# EAGLE design bl_interf (EAGLE 9.4.2)
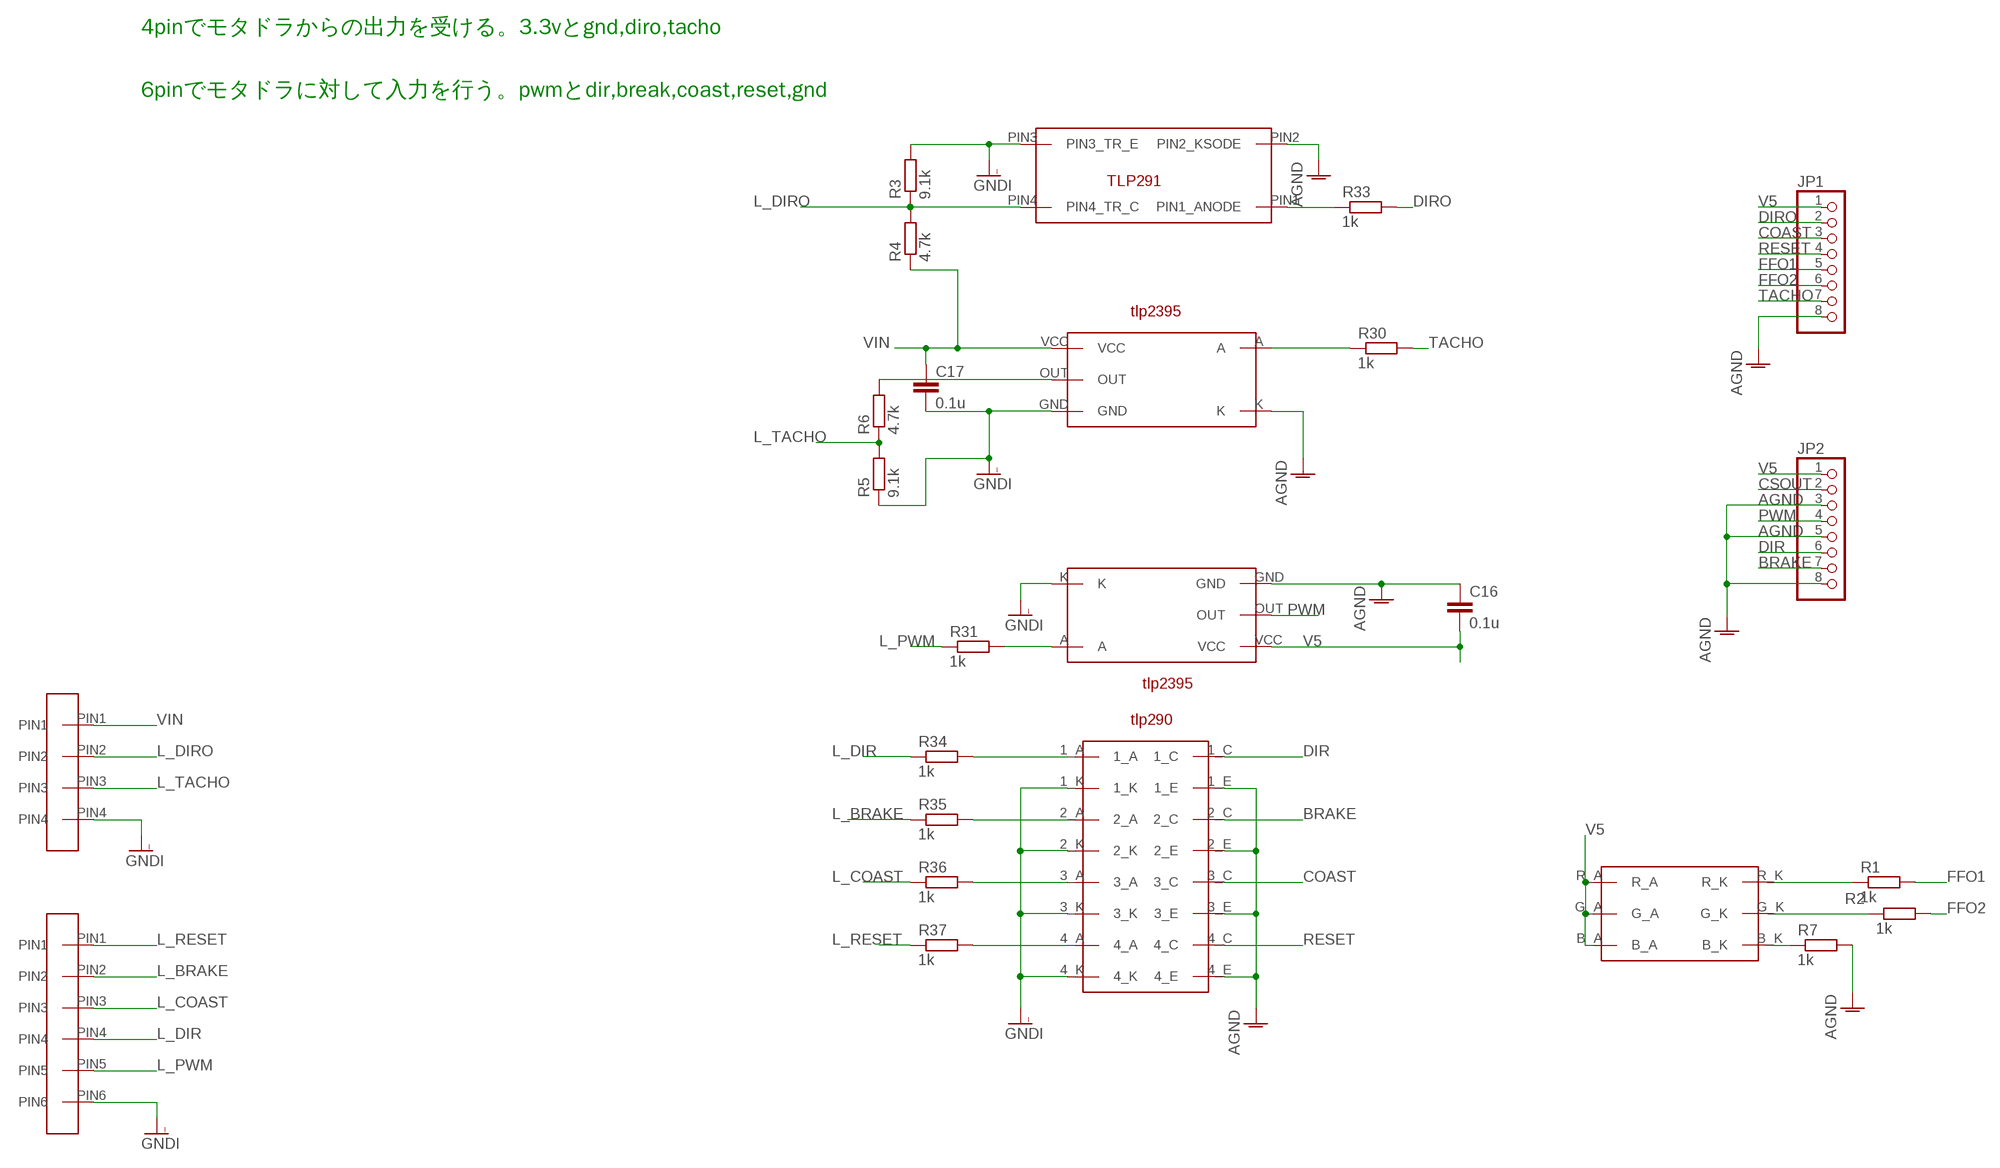
[diagram p0: schematic, sheet 1]

## Parts
C16  0.1u  C-EUC2012  [C2012]
C17  0.1u  C-EUC2012  [C2012]
JP1  PINHD-1X8  [1X08]
JP2  PINHD-1X8  [1X08]
R1  1k  R-EU_M2012  [M2012]
R2  1k  R-EU_M2012  [M2012]
R3  9.1k  R-EU_M2012  [M2012]
R4  4.7k  R-EU_M2012  [M2012]
R5  9.1k  R-EU_M2012  [M2012]
R6  4.7k  R-EU_M2012  [M2012]
R7  1k  R-EU_M2012  [M2012]
R30  1k  R-EU_M2012  [M2012]
R31  1k  R-EU_M2012  [M2012]
R33  1k  R-EU_M2012  [M2012]
R34  1k  R-EU_M2012  [M2012]
R35  1k  R-EU_M2012  [M2012]
R36  1k  R-EU_M2012  [M2012]
R37  1k  R-EU_M2012  [M2012]
U$1  RGB_LED  [RGB_LED]
U$17  TLP2395  [TLP2395]
U$18  TLP2395  [TLP2395]
U$19  TLP291  [TLP291]
U$20  TLP290-4  [TLP290]
U$21  DF1B_L_4P  [DF1B_L_4P]
U$22  DF1B_L_6P  [DF1B_L_6P]

## Nets
AGND: C16.1 JP1.8 JP2.3 JP2.5 JP2.8 R7.2 U$17.K U$18.GND U$19.PIN2(PIN2_KSODE) U$20.1_E U$20.2_E U$20.3_E U$20.4_E
BRAKE: JP2.7 U$20.2_C
COAST: JP1.3 U$20.3_C
CSOUT: JP2.2
DIR: JP2.6 U$20.1_C
DIRO: JP1.2 R33.2
FFO1: JP1.5 R1.2
FFO2: JP1.6 R2.2
GNDI: C17.2 R3.2 R5.1 U$17.GND U$18.K U$19.PIN3(PIN3_TR_E) U$20.1_K U$20.2_K U$20.3_K U$20.4_K U$21.PIN4 U$22.PIN6
L_BRAKE: R35.1 U$22.PIN2
L_COAST: R36.1 U$22.PIN3
L_DIR: R34.1 U$22.PIN4
L_DIRO: R3.1 R4.2 U$19.PIN4(PIN4_TR_C) U$21.PIN2
L_PWM: R31.1 U$22.PIN5
L_RESET: R37.1 U$22.PIN1
L_TACHO: R5.2 R6.1 U$21.PIN3
N$1: R7.1 U$1.B_K
N$2: R1.1 U$1.R_K
N$3: R2.1 U$1.G_K
N$34: R30.1 U$17.A
N$40: R31.2 U$18.A
N$41: R6.2 U$17.OUT
N$42: R34.2 U$20.1_A
N$43: R33.1 U$19.PIN1(PIN1_ANODE)
N$44: R35.2 U$20.2_A
N$45: R36.2 U$20.3_A
N$46: R37.2 U$20.4_A
PWM: JP2.4 U$18.OUT
RESET: JP1.4 U$20.4_C
TACHO: JP1.7 R30.2
V5: C16.2 JP1.1 JP2.1 U$1.B_A U$1.G_A U$1.R_A U$18.VCC
VIN: C17.1 R4.1 U$17.VCC U$21.PIN1

## Notes on the sheet
- 4pinでモタドラからの出力を受ける。3.3vとgnd,diro,tacho
- 6pinでモタドラに対して入力を行う。pwmとdir,break,coast,reset,gnd

## Library data of the parts
C16 C17 = rcl:C-EU: CAPACITOR, European symbol; SPICEPREFIX: C
JP1 JP2 = pinhead:PINHD-1X8: PIN HEADER
R1-R7 R30 R31 R33-R37 = rcl:R-EU_: RESISTOR, European symbol; SPICEPREFIX: R
U$1 = user:RGB_LED: 秋月電子通商 I-12726
U$17 U$18 = user:TLP2395
U$19 = user:TLP291
U$20 = user:TLP290-4
U$21 = user:DF1B_L_4P
U$22 = user:DF1B_L_6P

## Board
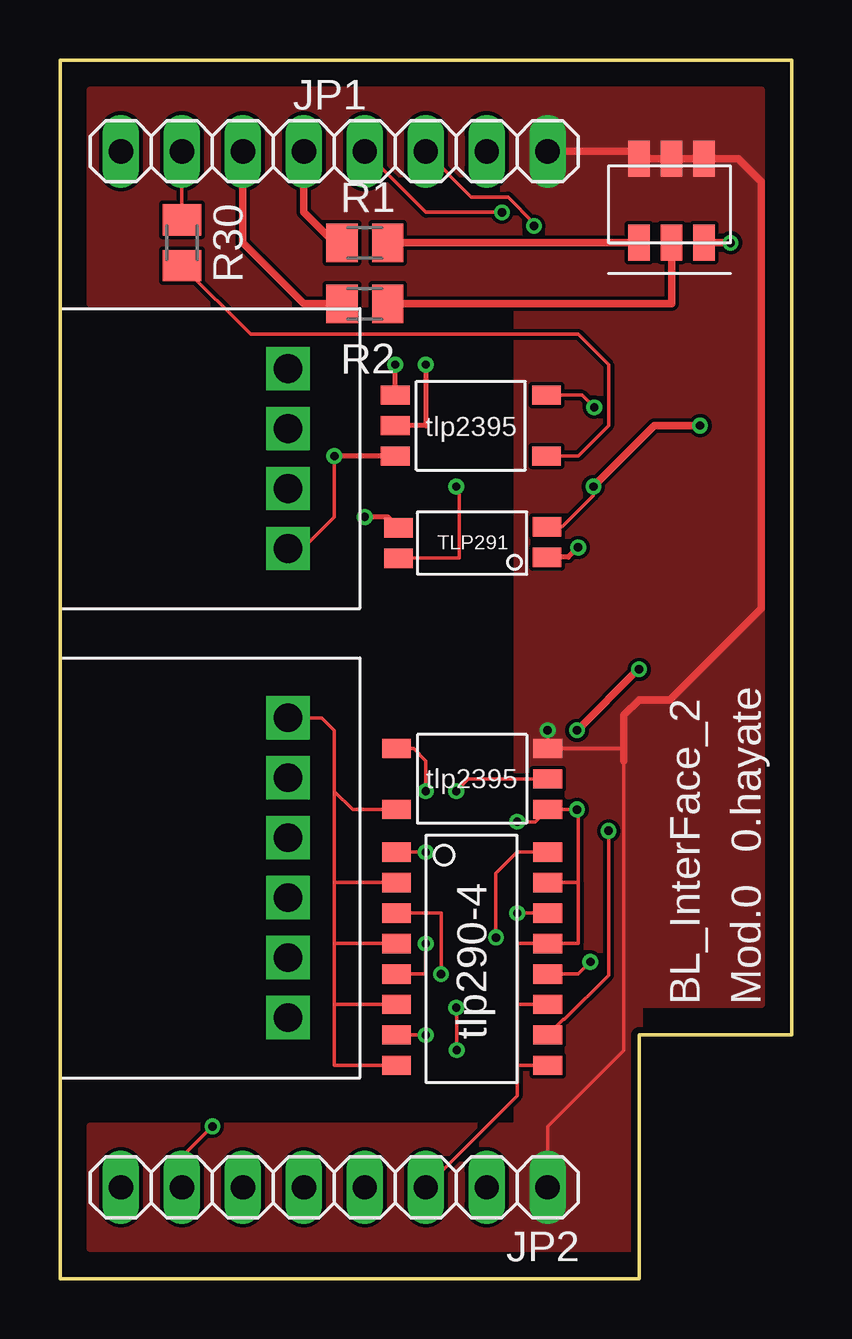
[diagram p1: board, top side]
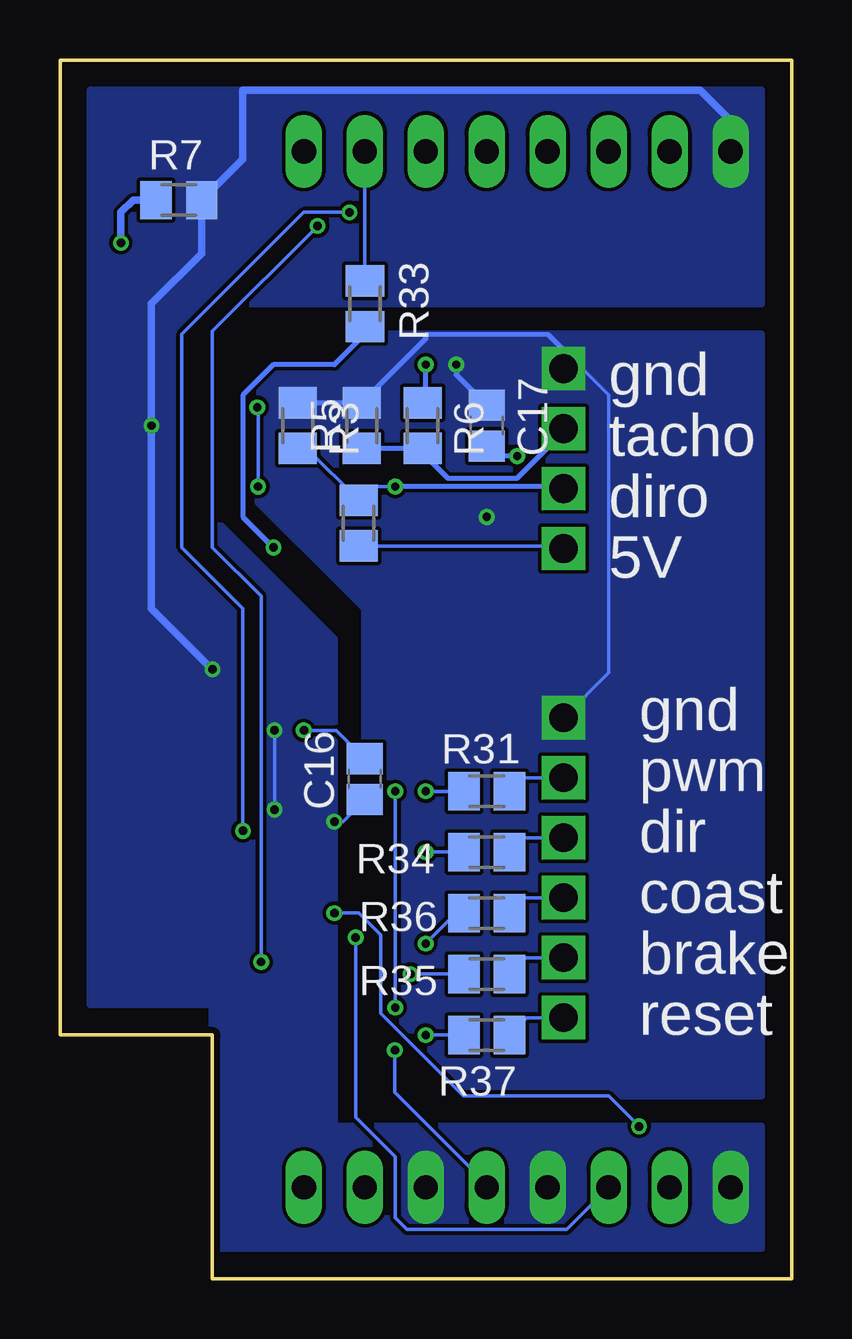
[diagram p2: board, bottom side, seen from below]

Size 30.48 x 50.8 mm. Coordinates in mm from the lower left corner, seen from the top.
Outline: 24.13,0 24.13,10.16 30.48,10.16 30.48,50.8 0,50.8 0,0 24.13,0
Copper layers (1*16): Top 0.035mm / dielectric 1.5mm / Bottom 0.035mm
Design rules "SeeedStudio_2layer_DRU_no_angle_20140221": minimum track width 6mil, minimum drill 12mil, track to track 6mil, track to pad 6mil, pad to pad 6mil, via to via 6mil, smd to smd 0mil, copper to edge 10mil, drill to drill 10mil, minimum pad ring 10mil, minimum via ring 6mil, stop-mask expansion 2mil, vias tented up to drill 100mil, thermal gap 10mil

### Footprints (pad centres in the part's own frame; a part is rotated, then mirrored left to right if it is on the bottom)
C2012 = smd 1.3 x 1.5: 1 -0.85,0; 2 0.85,0
1X08 = drill 1.016 long: 1 -8.89,0; 2 -6.35,0; 3 -3.81,0; 4 -1.27,0; 5 1.27,0; 6 3.81,0; 7 6.35,0; 8 8.89,0
M2012 = smd 1.3 x 1.6: 1 -0.95,0; 2 0.95,0
RGB_LED = smd 1.5 x 0.9: B_A 3.5,-2.7; B_K 0,-2.7; G_A 3.5,-1.35; G_K 0,-1.35; R_A 3.5,0; R_K 0,0
TLP2395 = smd 0.8 x 1.2: A 0,-6.3; GND 2.54,0; K 2.54,-6.3; OUT 1.27,0; VCC 0,0
TLP291 = smd 1.2 x 0.8: PIN1 0.411,-0.862; PIN2 0.411,-2.132; PIN3 6.601,-2.092; PIN4 6.601,-0.822
TLP290 = smd 0.8 x 1.2: 1_A 0,-6.3; 1_C 0,0; 1_E 1.27,0; 1_K 1.27,-6.3; 2_A 2.54,-6.3; 2_C 2.54,0; 2_E 3.81,0; 2_K 3.81,-6.3; 3_A 5.08,-6.3; 3_C 5.08,0; 3_E 6.35,0; 3_K 6.35,-6.3; 4_A 7.62,-6.3; 4_C 7.62,0; 4_E 8.89,0; 4_K 8.89,-6.3
DF1B_L_4P = drill 1.2 square: PIN1 2.5,-9.5; PIN2 5,-9.5; PIN3 7.5,-9.5; PIN4 10,-9.5
DF1B_L_6P = drill 1.2 square: PIN1 2.5,-9.5; PIN2 5,-9.5; PIN3 7.5,-9.5; PIN4 10,-9.5; PIN5 12.5,-9.5; PIN6 15,-9.5

### Placement (x,y rotation side)
C16  17.78,20.83 90 bottom
C17  12.7,35.56 90 bottom
JP1  11.43,46.99 180 top
JP2  11.43,3.81 180 top
R1  12.7,43.18 180 top
R2  12.7,40.64 180 top
R3  20.57,35.56 90 bottom
R4  18.03,31.5 90 bottom
R5  17.91,35.56 270 bottom
R6  15.37,35.56 90 bottom
R7  25.53,44.96 0 bottom
R30  5.08,43.18 90 top
R31  12.7,20.32 180 bottom
R33  17.78,40.64 90 bottom
R34  12.7,17.78 180 bottom
R35  12.7,12.7 180 bottom
R36  12.7,15.24 180 bottom
R37  12.7,10.16 180 bottom
U$1  24.13,43.18 90 top
U$17  13.97,34.29 90 top
U$18  20.32,22.1 270 top
U$19  20.7,29.21 180 top
U$20  20.32,17.78 270 top
U$21  0,27.94 90 top
U$22  0,8.38 90 top

### Tracks (layer width: path | path; a pad name or v marks a point on that pad's centre or on a via)
AGND  (via drill 0.35)
  Top 0.152: JP2.3 19.05,7.62 19.05,8.89 | 19.05,8.89 U$20.4_E | 19.05,8.89 19.05,11.43 | 19.05,11.43 U$20.3_E | 19.05,11.43 19.05,13.97 U$20.2_E 21.59,13.97 21.59,16.51 | U$20.1_E 21.59,16.51 | 21.59,16.51 21.59,19.56 v21.54,19.56 U$18.GND 19.81,19.05 v19.05,19.05 | U$19.PIN2 20.93,31.34 22.23,32.64 v22.23,33.02 | v22.26,36.32 21.75,36.83 U$17.K
  Top 0.305: v22.23,33.02 24.77,35.56 v26.67,35.56 | v21.54,22.86 24.08,25.4 v24.13,25.4
  Bottom 0.152: C16.1 18.71,19.05 v19.05,19.05 | v22.23,33.02 22.23,36.29 v22.26,36.32 | v21.54,19.56 v21.54,22.86
  Bottom 0.305: JP1.8 2.54,48.26 3.81,49.53 22.86,49.53 22.86,46.67 R7.2 24.58,42.73 26.67,40.64 v26.67,35.56 26.67,27.94 v24.13,25.4
  pour Bottom (no thermals): 1.27,49.53 29.21,49.53 29.21,11.43 24.13,11.43 24.13,1.27 1.27,1.27 1.27,6.35 19.05,6.35 19.05,26.67 24.13,31.75 24.13,39.37 22.86,40.64 1.27,40.64
BRAKE  (via drill 0.35)
  Top 0.152: v6.35,6.35 5.08,5.08 JP2.7 | v19.05,15.24 U$20.2_C
  Bottom 0.152: v19.05,15.24 18.03,15.24 17.12,14.32 17.12,11.05 13.69,7.62 10.16,7.62 7.62,7.62 v6.35,6.35
COAST  (via drill 0.35)
  Top 0.152: v22.1,13.21 21.59,12.7 U$20.3_C | v19.75,43.88 19.75,44.01 18.67,45.09 17.14,45.09 JP1.3
  Bottom 0.152: v22.1,13.21 22.1,28.45 24.13,30.48 24.13,39.5 v19.75,43.88
DIR  (via drill 0.35)
  Top 0.152: v18.16,14.22 18.16,16.89 19.05,17.78 U$20.1_C
  Bottom 0.152: JP2.6 9.37,2.06 16.03,2.06 16.51,2.54 16.51,5.08 18.16,6.73 v18.16,14.22
DIRO
  Bottom 0.152: R33.2 JP1.2
FFO1
  Top 0.305: JP1.5 10.16,44.45 11.43,43.18 R1.2
FFO2
  Top 0.305: R2.2 10.16,40.64 7.62,43.18 JP1.6
GNDI  (via drill 0.35)
  Top 0.152: U$22.PIN6 10.91,23.38 11.43,22.86 11.43,20.32 | 11.43,20.32 11.43,16.51 | 11.43,16.51 11.43,13.97 | 11.43,13.97 11.43,11.43 | 11.43,11.43 11.43,8.89 U$20.4_K | U$20.3_K 11.43,11.43 | U$20.2_K 11.43,13.97 | U$20.1_K 11.43,16.51 | U$18.K 12.19,19.56 11.43,20.32
  Top 0.2: U$17.GND v13.97,38.1 | U$19.PIN3 13.65,31.75 v12.7,31.75
  Bottom 0.152: U$21.PIN4 8.73,37.94 7.62,36.83 7.62,27.94 7.62,25.26 U$22.PIN6
  Bottom 0.2: R3.2 R5.1 15.24,39.18 15.24,39.37 10.16,39.37 9.5,38.71 U$21.PIN4 | v13.97,38.1 13.97,37.68 C17.2
  pour Bottom (no thermals): 1.27,39.37 22.86,39.37 22.86,33.02 17.78,27.94 17.78,7.62 1.27,7.62
L_BRAKE
  Bottom 0.152: U$22.PIN2 11.07,13.38 R35.1
L_COAST
  Bottom 0.152: U$22.PIN3 11.11,15.88 R36.1
L_DIR
  Bottom 0.152: U$22.PIN4 11.15,18.38 R34.1
L_DIRO  (via drill 0.35)
  Top 0.152: v16.51,33.02 16.64,32.89 16.64,30.03 U$19.PIN4
  Bottom 0.152: v16.51,33.02 17.46,33.02 R4.2 20.2,34.61 R3.1
  Bottom 0.2: U$21.PIN2 9.58,33.02 v16.51,33.02
L_PWM
  Bottom 0.152: U$22.PIN5 11.19,20.88 R31.1
L_RESET
  Bottom 0.152: U$22.PIN1 11.03,10.88 R37.1
L_TACHO
  Bottom 0.2: R5.2 R6.1 15.37,34.42 14.32,33.37 11.43,33.37 9.5,35.3 U$21.PIN3
N$1  (via drill 0.35)
  Top 0.305: U$1.B_K v27.94,43.18
  Bottom 0.305: v27.94,43.18 27.94,44.45 27.43,44.96 R7.1
N$2
  Top 0.305: R1.1 U$1.R_K
N$3
  Top 0.305: U$1.G_K 25.48,40.64 R2.1
N$34
  Top 0.152: R30.1 7.94,39.37 21.59,39.37 22.86,38.1 22.86,35.56 21.59,34.29 U$17.A
N$40  (via drill 0.35)
  Top 0.152: v15.24,20.32 15.24,21.59 14.73,22.1 U$18.A
  Bottom 0.152: R31.2 v15.24,20.32
N$41  (via drill 0.35)
  Top 0.2: v15.24,38.1 15.24,35.56 U$17.OUT
  Bottom 0.2: R6.2 15.24,36.64 v15.24,38.1
N$42  (via drill 0.35)
  Top 0.152: v15.24,17.78 U$20.1_A
  Bottom 0.152: R34.2 v15.24,17.78
N$43  (via drill 0.35)
  Top 0.2: v21.59,30.48 21.18,30.07 U$19.PIN1
  Bottom 0.2: R33.1 17.78,39.37 19.05,38.1 21.59,38.1 22.86,36.83 22.86,31.75 v21.59,30.48
N$44  (via drill 0.35)
  Top 0.152: v15.88,12.7 15.88,15.24 U$20.2_A
  Bottom 0.152: R35.2 v15.88,12.7
N$45  (via drill 0.35)
  Top 0.152: v15.24,13.97 15.24,12.7 U$20.3_A
  Bottom 0.152: R36.2 13.97,15.24 v15.24,13.97
N$46  (via drill 0.35)
  Top 0.152: v15.24,10.16 U$20.4_A
  Bottom 0.152: R37.2 v15.24,10.16
PWM  (via drill 0.35)
  Top 0.152: U$18.OUT 17.02,20.83 v16.51,20.32 | v16.51,11.3 16.53,11.28 v16.53,9.53
  Bottom 0.152: v16.51,20.32 v16.51,11.3 | v16.53,9.53 16.53,7.77 12.7,3.94 JP2.4
RESET  (via drill 0.35)
  Top 0.152: U$20.4_C 20.96,10.8 21.02,10.8 22.86,12.65 v22.86,18.67 | v18.41,44.45 15.24,44.45 JP1.4
  Bottom 0.152: v22.86,18.67 22.86,27.94 25.4,30.48 25.4,39.37 20.32,44.45 v18.41,44.45
TACHO
  Top 0.152: JP1.7 5.08,45.72 R30.2
V5  (via drill 0.35)
  Top 0.152: v20.32,22.86 U$18.VCC 23.5,22.1 23.5,21.59 23.5,9.53 20.32,6.35 JP2.1
  Top 0.305: JP1.1 23.82,46.99 U$1.R_A U$1.G_A U$1.B_A 28.25,46.68 29.21,45.72 29.21,27.94 27.94,26.67 25.4,24.13 24.13,24.13 23.5,23.5 23.5,21.59
  Bottom 0.152: C16.2 18.96,22.86 v20.32,22.86
  pour Top (no thermals): 1.27,40.64 1.27,49.53 29.21,49.53 29.21,11.43 24.13,11.43 24.13,1.27 1.27,1.27 1.27,6.35 19.05,6.35 19.05,40.64
VIN  (via drill 0.35)
  Top 0.152: v11.43,34.29 11.43,31.75 10.12,30.44 U$21.PIN1
  Top 0.2: U$17.VCC v11.43,34.29
  Bottom 0.152: U$21.PIN1 9.61,30.55 R4.1
  Bottom 0.2: v11.43,34.29 12.28,34.29
  Bottom 0.305: C17.1 12.28,34.29

### Text on the board
bPlace: gnd | tacho | diro | 5V | gnd | pwm | dir | coast | brake | reset
tNames: 0.hayate | BL_InterFace_2 | Mod.0